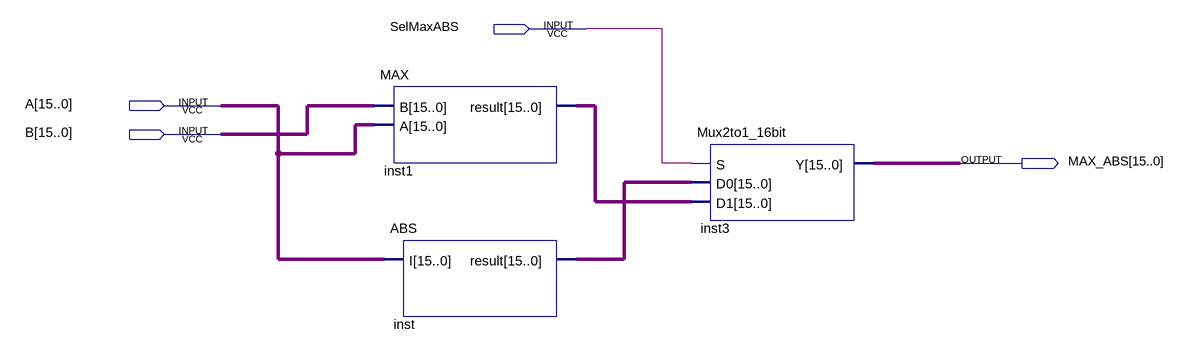
[diagram p0: schematic sheet]
// Quartus schematic Max_ABS.bdf as structural Verilog: 3 symbols, 4 pins
module Max_ABS (
  input  SelMaxABS,
  input  [15:0] A,
  input  [15:0] B,
  output [15:0] MAX_ABS
);

  wire [15:0] inst1_result, inst_result;

  MAX inst1 (.B(B), .A(A), .result(inst1_result));
  ABS inst (.I(A), .result(inst_result));
  Mux2to1_16bit inst3 (.S(SelMaxABS), .D0(inst_result), .D1(inst1_result), .Y(MAX_ABS));
endmodule
